# EAGLE design USB_carrier (EAGLE 5.11)
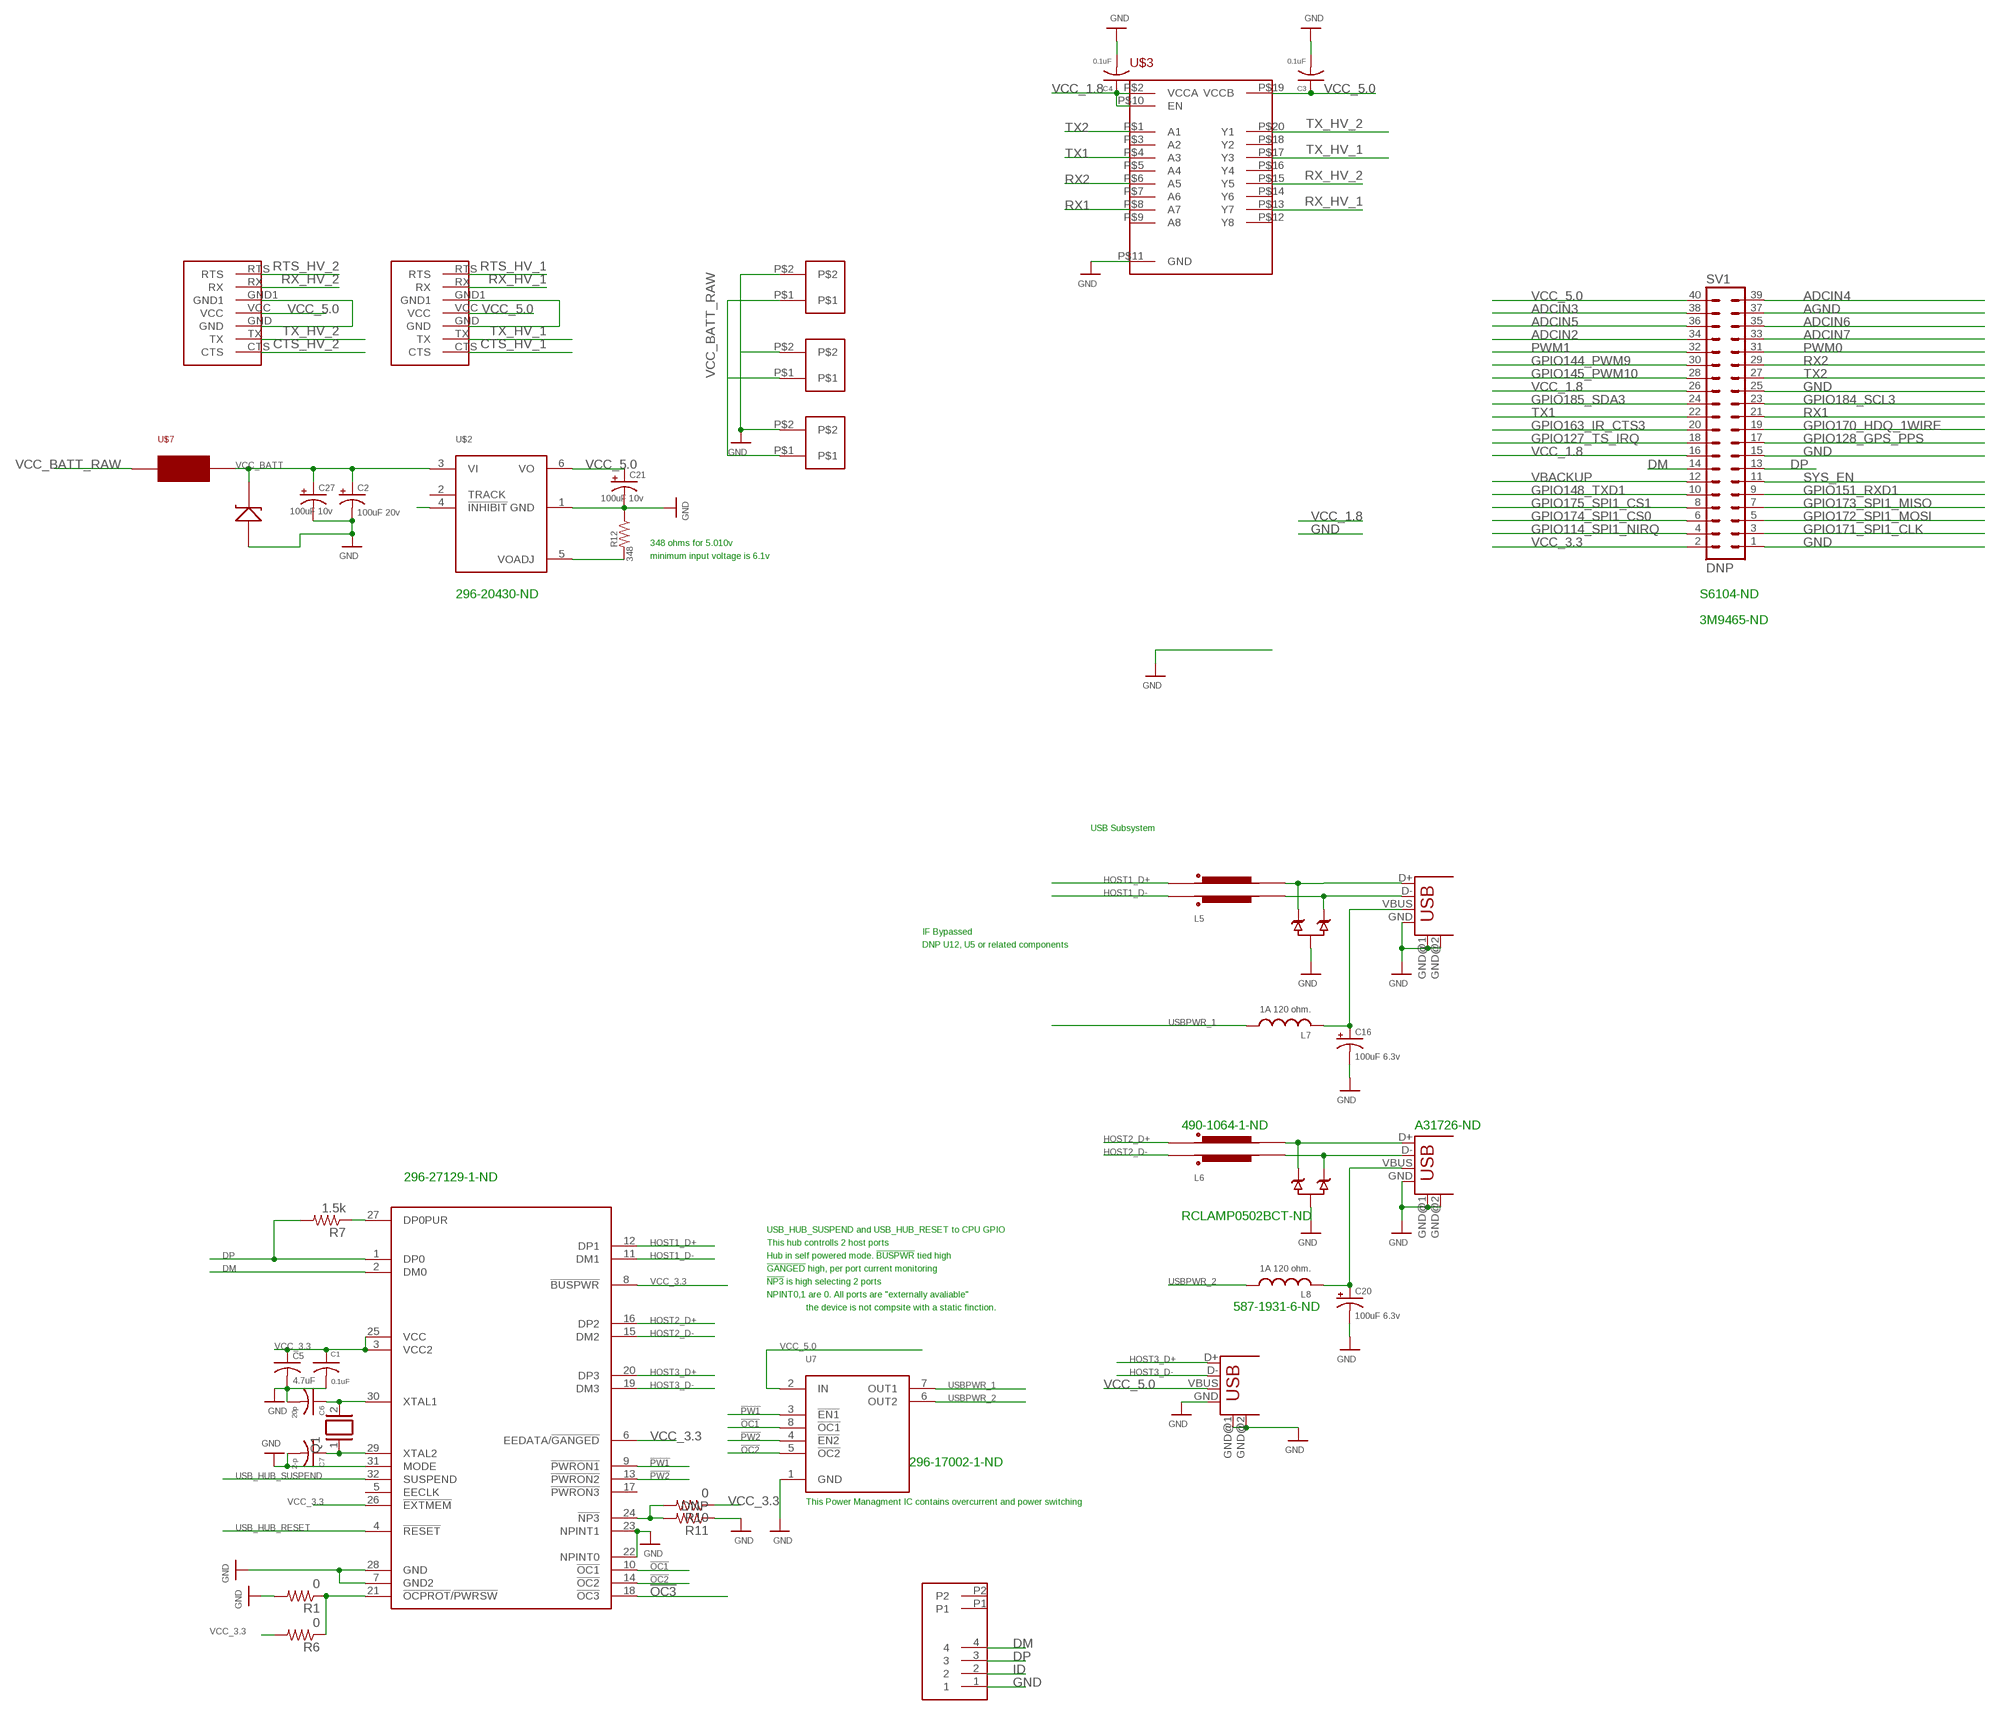
[diagram p0: schematic, sheet 1]

## Parts
C1  0.1uF  C0402-R  [C0402R]
C2  100uF 20v  CPOL-USE1.8-4  [E1,8-4]
C3  0.1uF  C0402-R  [C0402R]
C4  0.1uF  C0402-R  [C0402R]
C5  4.7uF  C-USC0603  [C0603]
C6  20p  C0402-R  [C0402R]
C7  2-p  C0402-R  [C0402R]
C16  100uF 6.3v  CPOL-USE1.8-4  [E1,8-4]
C20  100uF 6.3v  CPOL-USE1.8-4  [E1,8-4]
C21  100uF 10v  CPOL-USE1.8-4  [E1,8-4]
C27  100uF 10v  CPOL-USE1.8-4  [E1,8-4]
L5  FERITE_S0805  [SPLIT_0805]
L6  FERITE_S0805  [SPLIT_0805]
L7  1A 120 ohm.  L-USL2825P  [L2825P]
L8  1A 120 ohm.  L-USL2825P  [L2825P]
Q1  XTAL/S  [QS]
R1  0  R0402-R  [C0402R]
R6  0  R0402-R  [C0402R]
R7  1.5k  R0402-R  [C0402R]
R10  0  R0402-R  [C0402R]
R11  DNP  R0402-R  [C0402R]
R12  348  R-US_R0603  [R0603]
SV1  DNP  MA20-2  [MA20-2]
U5  RCLAMP0502B  [SOT-523]
U6  RCLAMP0502B  [SOT-523]
U7  TPS2042BDR  [SO08]
U12  TUSB2036  [S-PQFP-G32]
U$1  XF2L-0425-1A  [XF2L-0425-1A]
U$2  PTH08000W  [PTH08000W]
U$3  ADG3300  [TSSOP-20]
U$4  SK152  [DO-214AB]
U$7  0154  [0154]
U$8  WASP7PIN  [WASP7PIN]
U$9  2P  [2PTH]
U$10  WASP7PIN  [WASP7PIN]
U$11  2P  [2PTH]
U$12  2P  [2PTH]
USB1  USB-A-H  [USB-A-H]
USB2  USB-A-H  [USB-A-H]
USB3  USB-A-H  [USB-A-H]

## Nets
!OC1: U7.8(!OC1) U12.10(!OC1)
!OC2: U7.5(!OC2) U12.14(!OC2)
!OC3: U12.18(!OC3)
!PW1: U7.3(!EN1) U12.9(!PWRON1)
!PW2: U7.4(!EN2) U12.13(!PWRON2)
ADCIN2 [analog]: SV1.34
ADCIN3 [analog]: SV1.38
ADCIN4 [analog]: SV1.39
ADCIN5 [analog]: SV1.36
ADCIN6 [analog]: SV1.35
ADCIN7 [analog]: SV1.33
AGND [supply]: SV1.37
CTS_HV_1: U$8.CTS
CTS_HV_2: U$10.CTS
DM: SV1.14 U12.2(DM0) U$1.4
DP: R7.2 SV1.13 U12.1(DP0) U$1.3
GND [supply]: C1.2 C2.- C3.2 C4.2 C5.2 C6.2 C7.2 C16.- C20.- C21.- C27.- R1.2 R11.1 R12.1 SV1.1 SV1.15 SV1.25 U5.3 U6.3 U7.1(GND) U12.7(GND2) U12.22(NPINT0) U12.23(NPINT1) U12.28(GND) U12.31(MODE) U$1.1 U$2.1(GND) U$3.P$11(GND) U$4.AN U$8.GND U$8.GND1 U$9.P$2 U$10.GND U$10.GND1 U$11.P$2 U$12.P$2 USB1.GND USB1.GND@1(GND) USB1.GND@2(GND) USB2.GND USB2.GND@1(GND) USB2.GND@2(GND) USB3.GND USB3.GND@1(GND) USB3.GND@2(GND)
GPIO114_SPI1_NIRQ: SV1.4
GPIO127_TS_IRQ: SV1.18
GPIO128_GPS_PPS: SV1.17
GPIO144_PWM9: SV1.30
GPIO145_PWM10: SV1.28
GPIO148_TXD1: SV1.10
GPIO151_RXD1: SV1.9
GPIO163_IR_CTS3: SV1.20
GPIO170_HDQ_1WIRE: SV1.19
GPIO171_SPI1_CLK: SV1.3
GPIO172_SPI1_MOSI: SV1.5
GPIO173_SPI1_MISO: SV1.7
GPIO174_SPI1_CS0: SV1.6
GPIO175_SPI1_CS1: SV1.8
GPIO184_SCL3: SV1.23
GPIO185_SDA3: SV1.24
HOST1_D+: L5.1 U12.12(DP1)
HOST1_D+_UNFILTERED: L5.2 U5.2 USB1.D+
HOST1_D-: L5.4 U12.11(DM1)
HOST1_D-_UNFILTERED: L5.3 U5.1 USB1.D-
HOST2_D+: L6.1 U12.16(DP2)
HOST2_D-: L6.4 U12.15(DM2)
HOST3_D+: U12.20(DP3) USB3.D+
HOST3_D-: U12.19(DM3) USB3.D-
ID: U$1.2
N$1: R1.1 R6.1 U12.21(!OCPROT!/!PWRSW)
N$2: L6.3 U6.1 USB2.D-
N$3: C6.1 Q1.2 U12.30(XTAL1)
N$4: C7.1 Q1.1 U12.29(XTAL2)
N$7: R7.1 U12.27(DP0PUR)
N$9: L6.2 U6.2 USB2.D+
N$10: C16.+ L7.2 USB1.VBUS
N$11: R10.2 R11.2 U12.24(!NP3)
N$12: C20.+ L8.2 USB2.VBUS
N$24: R12.2 U$2.5(VOADJ)
N$25: U$2.4(!INHIBIT)
PWM0: SV1.31
PWM1: SV1.32
RTS_HV_1: U$8.RTS
RTS_HV_2: U$10.RTS
RX1: SV1.21 U$3.P$8(A7)
RX2: SV1.29 U$3.P$6(A5)
RX_HV_1: U$3.P$13(Y7) U$8.RX
RX_HV_2: U$3.P$15(Y5) U$10.RX
SYS_EN: SV1.11
TX1: SV1.22 U$3.P$4(A3)
TX2: SV1.27 U$3.P$1(A1)
TX_HV_1: U$3.P$17(Y3) U$8.TX
TX_HV_2: U$3.P$20(Y1) U$10.TX
USB_HUB_RESET: U12.4(!RESET)
USB_HUB_SUSPEND: U12.32(SUSPEND)
USBPWR_1: L7.1 U7.7(OUT1)
USBPWR_2: L8.1 U7.6(OUT2)
VBACKUP: SV1.12
VCC_1.8 [supply]: C4.1 SV1.16 SV1.26 U$3.P$2(VCCA) U$3.P$10(EN)
VCC_3.3 [supply]: C1.1 C5.1 R6.2 R10.1 SV1.2 U12.3(VCC2) U12.6(EEDATA/!GANGED) U12.8(!BUSPWR) U12.25(VCC) U12.26(!EXTMEM)
VCC_5.0: C3.1 C21.+ SV1.40 U7.2(IN) U$2.6(VO) U$3.P$19(VCCB) U$8.VCC U$10.VCC USB3.VBUS
VCC_BATT: C2.+ C27.+ U$2.3(VI) U$4.CAT U$7.2
VCC_BATT_RAW: U$7.1 U$9.P$1 U$11.P$1 U$12.P$1
Unconnected: U12.5(EECLK) U12.17(!PWRON3) U$1.P1 U$1.P2 U$2.2(TRACK) U$3.P$3(A2) U$3.P$5(A4) U$3.P$7(A6) U$3.P$9(A8) U$3.P$12(Y8) U$3.P$14(Y6) U$3.P$16(Y4) U$3.P$18(Y2)

## Notes on the sheet
- 348 ohms for 5.010v
- minimum input voltage is 6.1v
- 296-20430-ND | S6104-ND
- 3M9465-ND
- USB Subsystem
- IF Bypassed
- DNP U12, U5 or related components
- 490-1064-1-ND | A31726-ND
- 296-27129-1-ND
- RCLAMP0502BCT-ND
- USB_HUB_SUSPEND and USB_HUB_RESET to CPU GPIO
- This hub controlls 2 host ports
- Hub in self powered mode. !BUSPWR! tied high
- !GANGED! high, per port current monitoring
- !NP3! is high selecting 2 ports
- NPINT0,1 are 0. All ports are "externally avaliable"
- the device is not compsite with a static finction. | 587-1931-6-ND
- 296-17002-1-ND
- This Power Managment IC contains overcurrent and power switching

## Library data of the parts
C1 C3 C4 C6 C7 = qualified_1:C
C2 C21 C27 = resistor:CPOL-US: POLARIZED CAPACITOR, American symbol
C5 = rcl:C-US: CAPACITOR, American symbol
C16 C20 = rcl:CPOL-US: POLARIZED CAPACITOR, American symbol
L5 L6 = ferrite_split_0805:FERITE_S0805
L7 L8 = rcl:L-US: INDUCTOR, American symbol
Q1 = special:XTAL/S: CRYSTAL
R1 R6 R7 R10 R11 = qualified_1:R
R12 = rcl:R-US_: RESISTOR, American symbol
SV1 = con-lstb:MA20-2: PIN HEADER
U5 U6 = rclamp0502b:RCLAMP0502B
U7 = TPS2042BDR:TPS2042BDR
U12 = tusb2036:TUSB2036
U$1 = XF2L-0425-1A:XF2L-0425-1A
U$2 = PTH0800W:PTH08000W
U$3 = ADG3300:ADG3300
U$4 = SK152:SK152
U$7 = SMT_Fuse_0154001:0154
U$8 U$10 = wasp7pin:WASP7PIN
U$9 U$11 U$12 = con_2h_70555-0001:2P
USB1-USB3 = con-usb-2:USB: USB Connectors

## Net classes
5 USB: width 0.191 mm

## Board
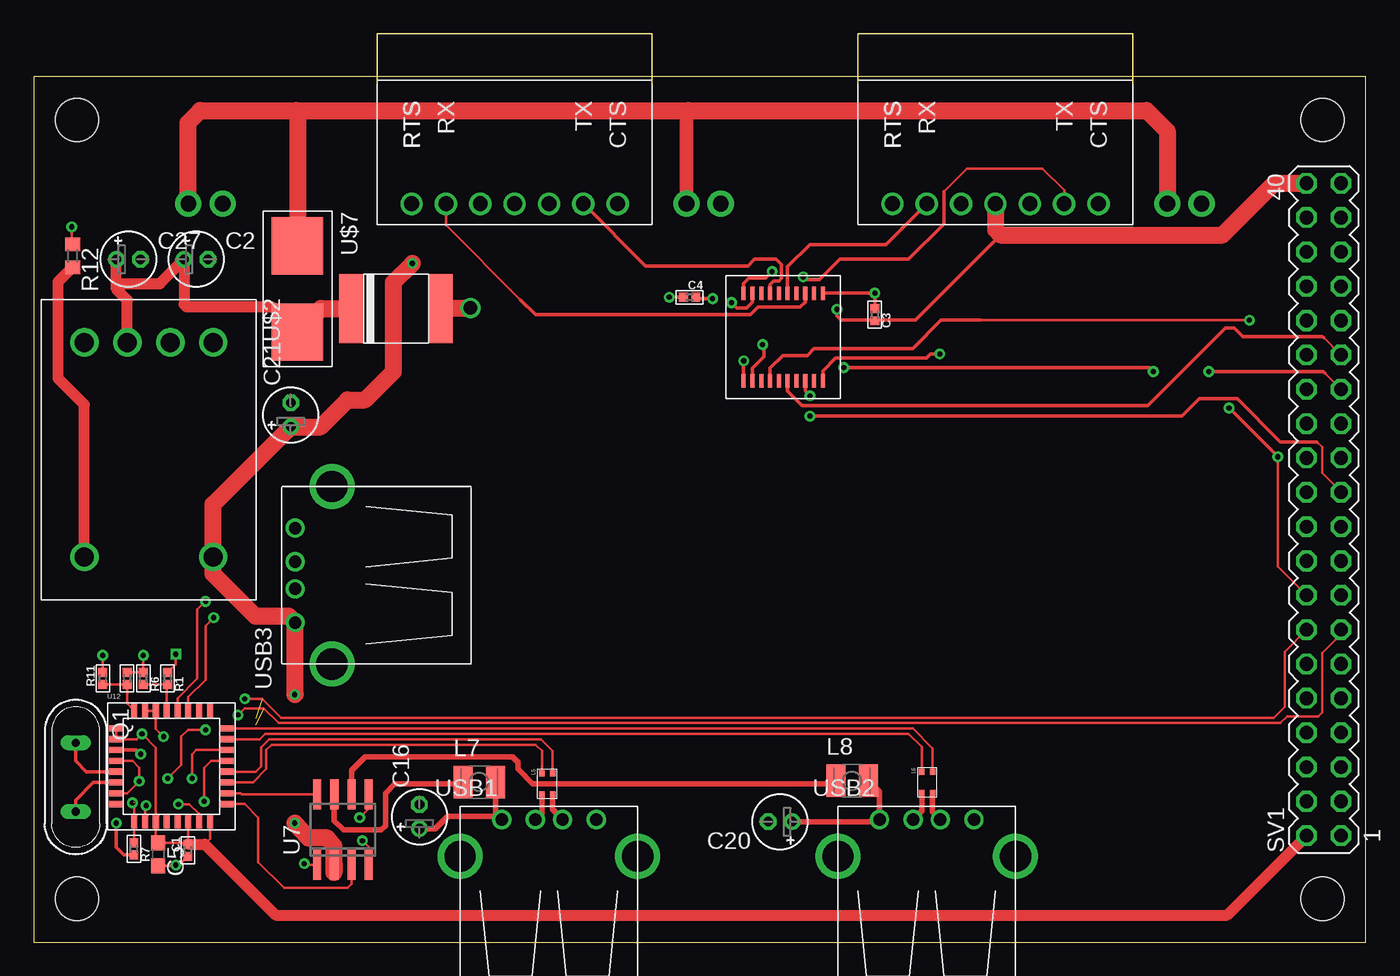
[diagram p1: board, top side]
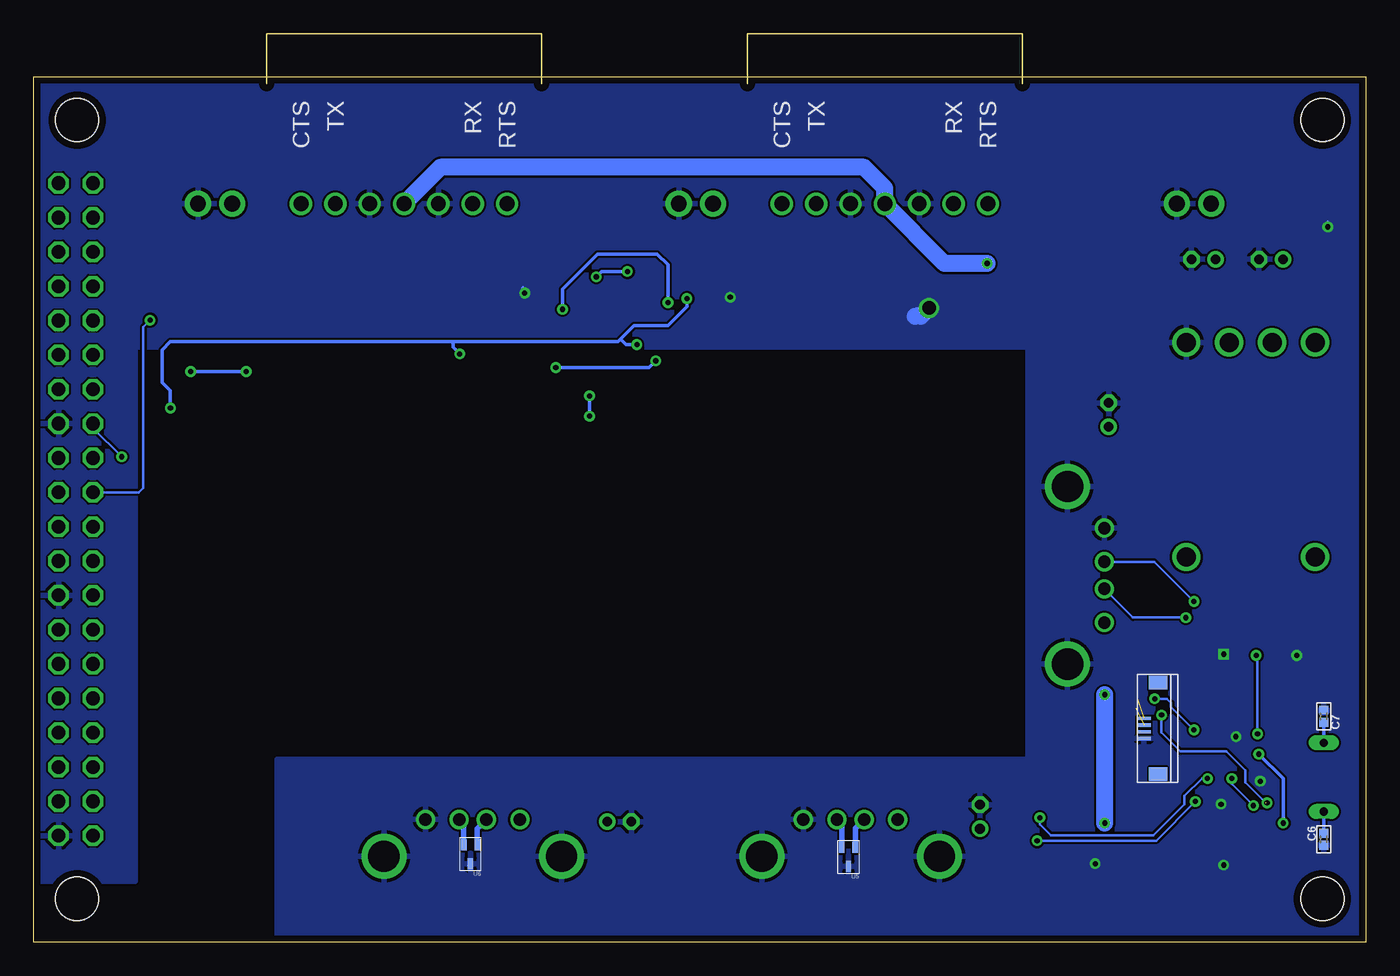
[diagram p2: board, bottom side, seen from below]

Size 98.5 x 64 mm. Coordinates in mm from the lower left corner, seen from the top.
Outline: 0,0 98.5,0 98.5,64 0,64 0,0
Copper layers (1*16): Top 0.035mm / dielectric 1.5mm / Bottom 0.035mm
Design rules "default *": minimum track width 6mil, minimum drill 15mil, track to track 6mil, track to pad 6mil, pad to pad 6mil, via to via 6mil, smd to smd 6mil, copper to edge 20mil, drill to drill 6mil, minimum pad ring 10mil, minimum via ring 8mil, stop-mask expansion 4mil, vias tented up to drill 20mil, thermal gap 10mil
Holes 3.2 mm at 3.2,60.8 95.3,60.8 95.3,3.2 3.2,3.2

### Footprints (pad centres in the part's own frame; a part is rotated, then mirrored left to right if it is on the bottom)
C0402R = smd 0.65 x 0.65: 1 -0.45,0; 2 0.45,0
E1,8-4 = drill 0.711 pad 1.168 round: + -0.889,0 | drill 0.711 pad 1.168 octagon: - 0.889,0
C0603 = smd 1.1 x 1: 1 -0.85,0; 2 0.85,0
SPLIT_0805 = smd 0.45 x 0.4: 1 0.225,-0.2; 2 1.775,-0.2; 3 1.775,-1; 4 0.225,-1
L2825P = smd 1.4 x 2.4: 1 -1.2,0; 2 1.2,0
QS = drill 0.61 long: 1 -2.54,0; 2 2.54,0
R0603 = smd 1 x 1.1: 1 -0.85,0; 2 0.85,0
MA20-2 = drill 1.016 octagon: 1 -24.13,-1.27; 2 -24.13,1.27; 3 -21.59,-1.27; 4 -21.59,1.27; 5 -19.05,-1.27; 6 -19.05,1.27; 7 -16.51,-1.27; 8 -16.51,1.27; 9 -13.97,-1.27; 10 -13.97,1.27; 11 -11.43,-1.27; 12 -11.43,1.27; 13 -8.89,-1.27; 14 -8.89,1.27; 15 -6.35,-1.27; 16 -6.35,1.27; 17 -3.81,-1.27; 18 -3.81,1.27; 19 -1.27,-1.27; 20 -1.27,1.27; 21 1.27,-1.27; 22 1.27,1.27; 23 3.81,-1.27; 24 3.81,1.27; 25 6.35,-1.27; 26 6.35,1.27; 27 8.89,-1.27; 28 8.89,1.27; 29 11.43,-1.27; 30 11.43,1.27; 31 13.97,-1.27; 32 13.97,1.27; 33 16.51,-1.27; 34 16.51,1.27; 35 19.05,-1.27; 36 19.05,1.27; 37 21.59,-1.27; 38 21.59,1.27; 39 24.13,-1.27; 40 24.13,1.27
SOT-523 = smd 0.4 x 0.8: 1 0,0; 2 1,0; 3 0.5,1.4
SO08 = smd 0.6 x 2.2: 1 -1.905,-2.6; 2 -0.635,-2.6; 3 0.635,-2.6; 4 1.905,-2.6; 5 1.905,2.6; 6 0.635,2.6; 7 -0.635,2.6; 8 -1.905,2.6
S-PQFP-G32 = smd 0.45 x 1: 1 -2.8,0.5; 2 -2,0.5; 3 -1.2,0.5; 4 -0.4,0.5; 5 0.4,0.5; 6 1.2,0.5; 7 2,0.5; 8 2.8,0.5; 17 2.8,8.7; 18 2,8.7; 19 1.2,8.7; 20 0.4,8.7; 21 -0.4,8.7; 22 -1.2,8.7; 23 -2,8.7; 24 -2.8,8.7 | smd 1 x 0.45: 9 4.05,1.8; 10 4.05,2.6; 11 4.05,3.4; 12 4.05,4.2; 13 4.05,5; 14 4.05,5.8; 15 4.05,6.6; 16 4.05,7.4; 25 -4.15,7.4; 26 -4.15,6.6; 27 -4.15,5.8; 28 -4.15,5; 29 -4.15,4.2; 30 -4.15,3.4; 31 -4.15,2.6; 32 -4.15,1.8
XF2L-0425-1A = smd 0.25 x 1: 1 -0.75,0.5; 2 -0.25,0.5; 3 0.25,0.5; 4 0.75,0.5 | smd 1 x 1.34: P1 -3.39,-0.55; P2 3.39,-0.55
PTH08000W = drill 1.4 round: 1 0,9.525; 2 0,6.35; 3 0,3.175; 4 0,0; 5 15.875,0; 6 15.875,9.525
TSSOP-20 = smd 0.3 x 1: P$1 0,0; P$2 0.65,0; P$3 1.3,0; P$4 1.95,0; P$5 2.6,0; P$6 3.25,0; P$7 3.9,0; P$8 4.55,0; P$9 5.2,0; P$10 5.85,0; P$11 5.85,6.5; P$12 5.2,6.5; P$13 4.55,6.5; P$14 3.9,6.5; P$15 3.25,6.5; P$16 2.6,6.5; P$17 1.95,6.5; P$18 1.3,6.5; P$19 0.65,6.5; P$20 0,6.5
DO-214AB = smd 1.778 x 5.08: AN -0.889,2.54; CAT 5.715,2.54
0154 = smd 4.24 x 3.81: 1 0,0; 2 6.38,0
WASP7PIN = drill 1.1 round: CTS 0,0; GND 5.08,0; GND1 10.16,0; RTS 15.24,0; RX 12.7,0; TX 2.54,0; VCC 7.62,0
2PTH = drill 1.168 pad 1.93 round: P$1 -2.54,0; P$2 0,0
USB-A-H = drill 0.914 round: D+ 2.718,-1.003; D- 2.718,1.003; GND 2.718,-3.493; VBUS 2.718,3.493 | drill 2.311 round: GND@1 0,6.566; GND@2 0,-6.566

### Placement (x,y rotation side)
C1  11.4,6.8 270 top
C2  12,50.5 0 top
C3  62.2,46.4 90 top
C4  48.5,47.7 180 top
C5  9.2,6.5 270 top
C6  3.1,7.6 270 bottom
C7  3.1,16.7 90 bottom
C16  28.53,9.27 90 top
C20  55.2,8.91 180 top
C21  19,39 90 top
C27  7,50.5 0 top
L5  38.57,12.7 270 top
L6  66.67,12.81 270 top
L7  32.94,11.84 0 top
L8  60.51,11.94 0 top
Q1  3.1,12.2 270 top
R1  9.9,19.5 90 top
R6  8.1,19.5 90 top
R7  7.4,6.9 90 top
R10  6.9,19.5 270 top
R11  5.1,19.5 270 top
R12  2.87,50.76 270 top
SV1  95.4,32 90 top
U5  37.75,7 180 bottom
U6  65.71,7.2 180 bottom
U7  22.86,8.32 0 top
U12  10.23,8.41 0 top
U$1  15.9,15.8 90 bottom
U$2  3.74,44.36 270 top
U$3  52.5,41.5 0 top
U$4  29.2,49.4 180 top
U$7  19.5,51.5 270 top
U$8  43.18,54.61 180 top
U$9  86.36,54.61 0 top
U$10  78.74,54.61 180 top
U$11  13.97,54.61 0 top
U$12  50.8,54.61 0 top
USB1  38.1,6.35 90 top
USB2  66.04,6.35 90 top
USB3  22.05,27.13 180 top

### Tracks (layer width: path | path; a pad name or v marks a point on that pad's centre or on a via)
!OC1
  Top 0.203: U7.8 15.38,10.92 15.3,11 U12.10
!OC2  (via drill 0.38)
  Top 0.203: U7.5 24.77,9.87 v24.1,9.2 | v11.7,12.1 11.7,13.9 12.01,14.21 U12.14
  Bottom 0.203: v24.1,9.2 24.1,8.7 23.3,7.9 15.7,7.9 13.4,10.2 13.4,10.8 12.1,12.1 v11.7,12.1
!PW1
  Top 0.203: U12.9 15.59,10.21 16.6,9.2 16.6,5.9 18.5,4 23.2,4 23.5,4.3 U7.3
!PW2  (via drill 0.38)
  Top 0.203: U7.4 24.77,7.04 v24.3,7.5 | v12.6,10.4 12.6,12.9 13.1,13.4 U12.13
  Bottom 0.203: v24.3,7.5 15.5,7.5 v12.6,10.4
DM  (via drill 0.38)  (1 unrouted)
  Top 0.203: v8.3,10.1 8.23,10.03 U12.2 | v9.9,12.1 10.9,13.1 10.9,15.2 11.4,15.7 v12.7,15.7 | v15.6,18 16.9,18 18.3,16.6 91.7,16.6 92.5,17.4 92.5,21.48 SV1.14
  Bottom 0.203: v8.3,10.1 9.9,11.7 v9.9,12.1 | v12.7,15.7 14.4,17.4 14.4,17.7 14.7,18 v15.6,18
DP  (via drill 0.38)  (2 unrouted)
  Top 0.203: R7.2 7.43,7.38 U12.1 7.43,10.33 | v15.1,16.8 15.6,17.3 17,17.3 18.1,16.2 92.2,16.2 92.7,16.7 95,16.7 95.3,17 95.3,21.4 96.67,22.77 SV1.13
  Bottom 0.203: v7.3,10.3 7.4,10.3 8.9,11.8 8.9,12.7 10.3,14.1 13.7,14.1 15.1,15.5 v15.1,16.8
GND  (via drill 0.38, 1)
  Top 0.203: U7.1 20.08,5.72 v20,5.8 | U12.23 U12.22 9.03,15.77 v9.6,15.2 | R11.1 v5.1,21.2 | C5.2 10.7,5.65 C1.2 11.35,6.35 10.7,5.7 v10.5,5.7 | U12.28 7.3,13.4 7.8,12.9 v7.8,11.9 6.91,11.01 U12.31 | U12.7 12.23,9.47 11.5,10.2 v10.7,10.2 | R1.2 10.5,20.55 v10.5,21.3 | R12.1 2.8,51.68 v2.8,52.9
  Top 0.254: C4.2 v47,47.7 | C3.2 v62.2,48 U$3.P$11
  Top 1.27: U$4.AN 30.13,46.9 v32.3,46.9
  Bottom 0.203: v20,5.8 20,5.7 19.9,5.6 | v5.1,21.2 5.1,21.4 | v9.6,15.2 9.9,15.2 | v7.8,11.9 8,11.9 | v10.7,10.2 10.7,10.4 | v10.5,5.7 10.5,5.5 | v10.5,21.3 10.3,21.3 | v2.8,52.9 2.8,53.3
  Bottom 0.254: v47,47.7 47,48 | v62.2,48 62.3,48.1 62.3,48.4
  Bottom 1.27: v32.3,46.9 32.9,46.3 33.3,46.3
  pour Bottom: -1,65 100,65 100,41.5 100,4.5 91,4.5 91,44 78.5,44 25,44 25,13.5 80.5,13.5 80.5,-1.5 -1,-1.5
HOST1_D+
  Top 0.203: L5.1 38.37,14.13 37.5,15 17.4,15 16.8,14.4 16.8,13 16.4,12.6 U12.12
HOST1_D+_UNFILTERED
  Top 0.406: L5.2 38.37,9.8 USB1.D+
  Bottom 0.406: U5.2 38.75,8.71 USB1.D+
HOST1_D-
  Top 0.203: L5.4 37.57,14.13 37.1,14.6 17.6,14.6 17.2,14.2 17.2,12.8 16.21,11.81 U12.11
HOST1_D-_UNFILTERED
  Top 0.406: L5.3 37.57,9.54 USB1.D-
  Bottom 0.406: U5.1 37.75,8.41 USB1.D-
HOST2_D+
  Top 0.203: L6.1 66.47,14.33 65,15.8 U12.16
HOST2_D-
  Top 0.203: L6.4 65.67,14.43 64.7,15.4 17.1,15.4 16.71,15.01 U12.15
HOST3_D+  (via drill 0.38)
  Top 0.203: U12.20 10.63,18.03 12.1,19.5 12.1,24.6 v12.7,25.2
  Bottom 0.203: v12.7,25.2 15.63,28.13 USB3.D+
HOST3_D-  (via drill 0.38)
  Top 0.203: U12.19 11.43,18.13 12.7,19.4 12.7,23.4 v13.3,24
  Bottom 0.203: v13.3,24 17.21,24 USB3.D-
N$1
  Top 0.203: U12.21 9.83,18.98 R1.1 R6.1
N$2
  Top 0.406: L6.3 65.67,9.7 USB2.D-
  Bottom 0.406: U6.1 65.71,8.39 USB2.D-
N$3
  Top 0.254: U12.30 4.41,11.81 3.1,10.5 Q1.2
  Bottom 0.254: C6.1 Q1.2
N$4
  Top 0.254: U12.29 3.89,12.61 3.1,13.4 Q1.1
  Bottom 0.254: Q1.1 C7.1
N$7  (via drill 0.38)
  Top 0.254: R7.1 6.65,6.45 6.1,7 v6.1,8.8 | v7.9,13.9 7.59,14.21 U12.27
  Bottom 0.254: v6.1,8.8 6.1,12.1 v7.9,13.9
N$9
  Top 0.406: L6.2 66.47,9.64 USB2.D+
  Bottom 0.406: U6.2 66.71,8.73 USB2.D+
N$10
  Top 0.406: L7.2 34.14,9.54 USB1.VBUS 34.38,9.3 30.6,9.3 29.68,8.38 C16.+
N$11
  Top 0.203: U12.24 6.9,17.64 R10.2 R11.2
N$12
  Top 0.406: L8.2 62.55,11.1 USB2.VBUS 62.39,8.91 C20.+
N$24
  Top 0.813: U$2.5 3.74,39.76 1.8,41.7 1.8,48.84 R12.2
RX1  (via drill 0.38)
  Top 0.203: SV1.21 96.67,33.33 95.3,34.7 95.3,36.6 94.9,37
  Top 0.254: 94.9,37 92.2,37 89,40.2 86.2,40.2 84.9,38.9 v57.4,38.9 | U$3.P$8 57.05,40.75 v57.4,40.4
  Bottom 0.254: v57.4,38.9 v57.4,40.4
RX2
  Top 0.203: 95.4,44.7 SV1.29
  Top 0.254: 95.4,44.7 95.3,44.8 89.4,44.8 88.8,45.4 88.1,45.4 82.4,39.7 56.8,39.7 55.75,40.75 U$3.P$6
RX_HV_1
  Top 0.203: U$8.RX 30.48,53.02 36,47.5
  Top 0.254: 36,47.5 37.1,46.4 53,46.4 53.55,46.95 56.65,46.95 57.05,47.35 U$3.P$13
RX_HV_2
  Top 0.254: U$10.RX 63.03,51.6 57.4,51.6 55.75,49.95 U$3.P$15
TX1  (via drill 0.38)
  Top 0.203: 70,46 v89.9,46
  Top 0.254: 70,46 67.1,46 65,43.9 57.7,43.9 57.2,43.4 55.4,43.4 54.45,42.45 U$3.P$4
  Bottom 0.203: SV1.22 90.73,33.27 90.4,33.6 90.4,45.5 v89.9,46
TX2  (via drill 0.38)
  Top 0.203: 95.46,42.1 SV1.27
  Top 0.254: 95.46,42.1 95.36,42.2 v86.9,42.2 | v82.8,42.2 82.5,42.5 v59.9,42.5 | U$3.P$1 v52.5,43
  Bottom 0.254: v82.8,42.2 v86.9,42.2 | v59.9,42.5 53,42.5 v52.5,43
TX_HV_1
  Top 0.254: U$8.TX 45.25,50 52.8,50 53.3,50.5 54.9,50.5 55.3,50.1 55.3,49.1 55.1,48.9 54.7,48.9 54.45,48.65 U$3.P$17
TX_HV_2  (via drill 0.38)
  Top 0.203: U$10.TX 76.2,55.6 74.6,57.2 69,57.2 67.3,55.5
  Top 0.254: 67.3,55.5 67.3,53.1 64.7,50.5 59.6,50.5 58.1,49 57.1,49 v56.9,49.2 | U$3.P$20 52.5,48.7 52.9,49.1 54.1,49.1 v54.6,49.6
  Bottom 0.254: v54.6,49.6 56.5,49.6 v56.9,49.2
USBPWR_1
  Top 0.406: L7.1 31.6,11.7 26.7,11.7 26,11 26,8.6 25.7,8.3 22.9,8.3 22.23,8.97 U7.7
USBPWR_2
  Top 0.406: U7.6 23.5,12.7 24.5,13.7 35.4,13.7 35.8,13.3 35.8,12.8 36.9,11.7 58.8,11.7 58.8,11.94 L8.1
VCC_1.8  (via drill 0.38)
  Top 0.203: SV1.16 92,27.78 v92,35.9
  Top 0.254: 50.3,47.7 v50.2,47.6 49.05,47.6 C4.1 | v88.4,39.5 v92,35.9 | v67,43.5 66.3,43.5 66,43.2 59.3,43.2 58.35,42.25 U$3.P$10 | U$3.P$2 53.15,42.45 54,43.3 54,44.1 v53.9,44.2
  Bottom 0.203: v92,35.9 94.13,38.03 SV1.26
  Bottom 0.254: v50.2,47.6 50.2,47 51.6,45.6 54.1,45.6 55.1,44.6 | 55.1,44.6 55.3,44.4 67.5,44.4 | 67.5,44.4 88.4,44.4 89,43.8 89,41.4 88.4,40.8 v88.4,39.5 | v67,43.5 67.5,44 67.5,44.4 | v53.9,44.2 54.7,44.2 55.1,44.6
VCC_3.3  (via drill 0.38)
  Top 0.203: R10.1 R6.2 v8.1,21.2 | U12.25 U12.26 7.61,15.01 v8,15.4 9.03,14.37 U12.3 9.03,7.52 C5.1 11.3,7.35 C1.1 11.4,8.88 U12.6 | U12.8 13.03,7.63 12.65,7.25
  Top 0.813: SV1.2 88.26,2 17.9,2 12.65,7.25 C1.1
  Bottom 0.203: v8.1,21.2 8,21.1 v8,15.4
VCC_5.0  (via drill 0.38)
  Top 0.254: 62.25,46 59.7,46 59.4,46.3 v59.4,46.8 | 71.5,52.3 65.2,46 62.25,46 | 62.25,46 C3.1 | U$3.P$19 53.15,47.35 52.7,46.9 52,46.9 v51.6,47.3
  Top 1.27: v19.3,18.3 19.33,18.33 USB3.VBUS 18.87,24.1 16.4,24.1 13.27,27.23 U$2.6 13.27,32.38 C21.+ 21.21,38.11 23.2,40.1 24.5,40.1 26.6,42.2 26.6,48.8 v28,50.2 | v19.3,8.8 20.3,7.7 21.7,7.7 22.2,7.1 22.2,5.14 U7.2 | SV1.40 91.73,56.13 87.9,52.3 71.5,52.3 71.12,52.68 U$10.VCC
  Bottom 0.254: v51.6,47.3 51.6,50.1 52.4,50.9 56.8,50.9 59.4,48.3 v59.4,46.8
  Bottom 1.27: U$10.VCC 68.43,57.3 37.1,57.3 35.56,55.76 U$8.VCC 31.15,50.2 v28,50.2 | v19.3,8.8 v19.3,18.3
VCC_BATT
  Top 0.813: U$2.3 6.92,47.48 6.1,48.3 6.1,48.7 | 6.1,48.7 6.1,50.49 C27.+ | U$7.2 17.62,47 11.3,47 11.11,47.19 C2.+ 9.31,48.7 6.1,48.7
  Top 1.27: U$7.2 21.24,46.86 U$4.CAT
VCC_BATT_RAW
  Top 1.016: 48.26,61.36 U$12.P$1
  Top 1.27: U$9.P$1 83.82,59.98 82.3,61.5 48.4,61.5 | 19.4,61.5 12.3,61.5 11.4,60.6 11.4,54.64 U$11.P$1 | 19.4,61.5 48.4,61.5 | U$7.1 19.5,61.4 19.4,61.5 | 48.4,61.5 48.26,61.36